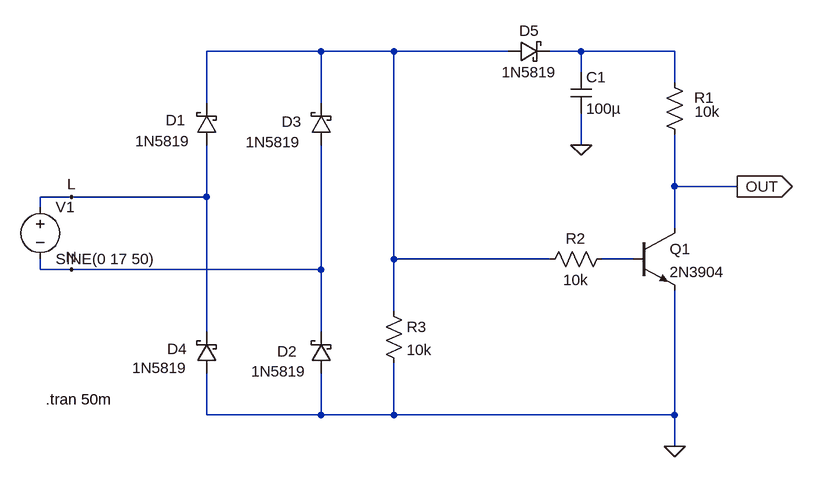
[diagram p0: schematic v1.0.asc]
v1.0.asc, the LTspice schematic file:
Version 4.1
SHEET 1 2188 680
WIRE 224 -256 48 -256
WIRE 336 -256 224 -256
WIRE 512 -256 336 -256
WIRE 624 -256 576 -256
WIRE 768 -256 624 -256
WIRE 624 -224 624 -256
WIRE 768 -208 768 -256
WIRE 48 -176 48 -256
WIRE 224 -176 224 -256
WIRE 624 -112 624 -160
WIRE 768 -48 768 -128
WIRE 864 -48 768 -48
WIRE -160 -32 -208 -32
WIRE 48 -32 48 -112
WIRE 48 -32 -160 -32
WIRE -208 -16 -208 -32
WIRE 768 16 768 -48
WIRE 336 64 336 -256
WIRE 576 64 336 64
WIRE 704 64 656 64
WIRE -208 80 -208 64
WIRE -160 80 -208 80
WIRE 224 80 224 -112
WIRE 224 80 -160 80
WIRE 336 144 336 64
WIRE 48 176 48 -32
WIRE 224 176 224 80
WIRE 48 304 48 240
WIRE 224 304 224 240
WIRE 224 304 48 304
WIRE 336 304 336 224
WIRE 336 304 224 304
WIRE 768 304 768 112
WIRE 768 304 336 304
WIRE 768 352 768 304
FLAG 768 352 0
FLAG 864 -48 OUT
IOPIN 864 -48 Out
FLAG 624 -112 0
FLAG -160 -32 L
FLAG -160 80 N
SYMBOL voltage -208 -32 R0
WINDOW 123 0 0 Left 0
WINDOW 39 0 0 Left 0
SYMATTR InstName V1
SYMATTR Value SINE(0 17 50)
SYMBOL schottky 64 -112 R180
WINDOW 0 48 38 Left 2
WINDOW 3 41 6 Left 2
SYMATTR InstName D1
SYMATTR Value 1N5819
SYMATTR Description Diode
SYMATTR Type diode
SYMBOL schottky 240 240 R180
WINDOW 0 53 34 Left 2
WINDOW 3 39 3 Left 2
SYMATTR InstName D2
SYMATTR Value 1N5819
SYMATTR Description Diode
SYMATTR Type diode
SYMBOL schottky 240 -112 R180
WINDOW 0 46 36 Left 2
WINDOW 3 47 4 Left 2
SYMATTR InstName D3
SYMATTR Value 1N5819
SYMATTR Description Diode
SYMATTR Type diode
SYMBOL schottky 64 240 R180
WINDOW 0 46 38 Left 2
WINDOW 3 46 9 Left 2
SYMATTR InstName D4
SYMATTR Value 1N5819
SYMATTR Description Diode
SYMATTR Type diode
SYMBOL res 784 -112 R180
WINDOW 0 -45 73 Left 2
WINDOW 3 -54 51 Left 2
SYMATTR InstName R1
SYMATTR Value 10k
SYMBOL schottky 512 -240 R270
WINDOW 0 32 32 VTop 2
WINDOW 3 0 32 VBottom 2
SYMATTR InstName D5
SYMATTR Value 1N5819
SYMATTR Description Diode
SYMATTR Type diode
SYMBOL res 672 48 R90
WINDOW 0 0 56 VBottom 2
WINDOW 3 32 56 VTop 2
SYMATTR InstName R2
SYMATTR Value 10k
SYMBOL npn 704 16 R0
SYMATTR InstName Q1
SYMATTR Value 2N3904
SYMBOL cap 608 -224 R0
SYMATTR InstName C1
SYMATTR Value 100µ
SYMBOL res 320 128 R0
SYMATTR InstName R3
SYMATTR Value 10k
TEXT -200 280 Left 2 !.tran 50m

The netlist it stands for:
* v1.0.asc
V1 L N SINE(0 17 50)
D1 L N001 1N5819
D2 0 N 1N5819
D3 N N001 1N5819
D4 0 L 1N5819
R1 OUT N002 10k
D5 N001 N002 1N5819
R2 N003 N001 10k
Q1 OUT N003 0 0 2N3904
C1 N002 0 100µ
R3 N001 0 10k
.model D D
.lib standard.dio
.model NPN NPN
.model PNP PNP
.lib standard.bjt
.tran 50m
.backanno
.end